# EAGLE design am (EAGLE 9.5.2)
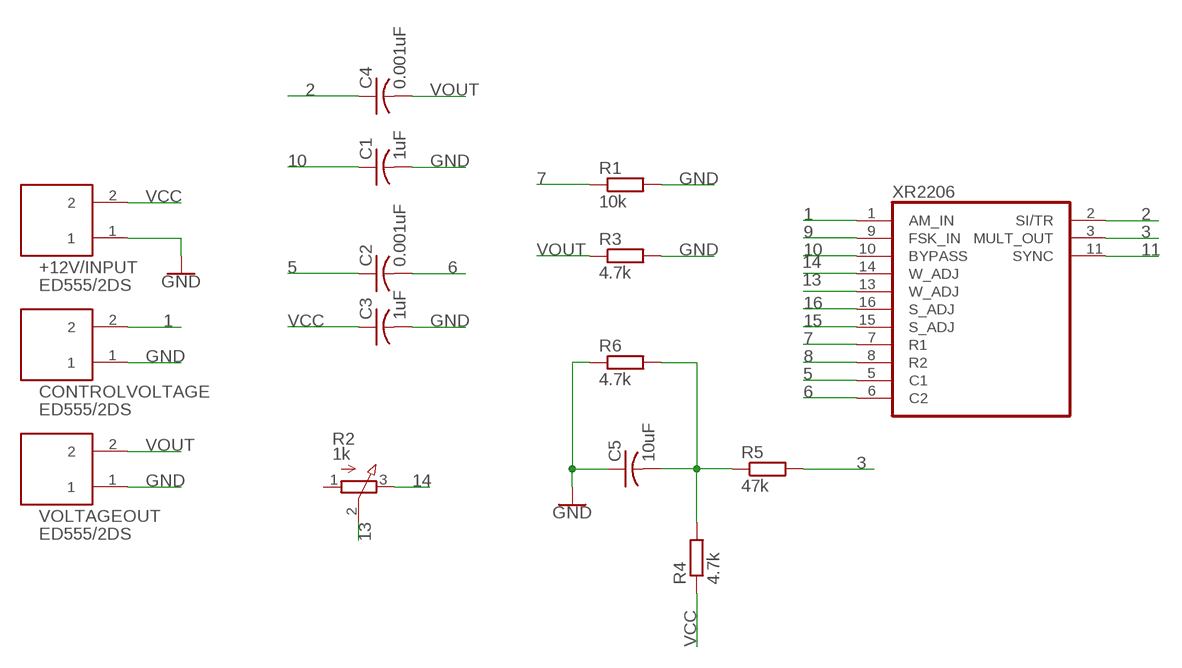
[diagram p0: schematic, sheet 1]

## Parts
+12V/INPUT  ED555/2DS  [ED555/2DS]
C1  1uF  C-US050-030X075  [C050-030X075]
C2  0.001uF  C-US050-030X075  [C050-030X075]
C3  1uF  C-US050-030X075  [C050-030X075]
C4  0.001uF  C-US050-030X075  [C050-030X075]
C5  10uF  C-US050-030X075  [C050-030X075]
CONTROLVOLTAGE  ED555/2DS  [ED555/2DS]
R1  10k  R-EU_0207/10  [0207/10]
R2  1k  3RP/1610N  [3RP/1610N]
R3  4.7k  R-EU_0207/10  [0207/10]
R4  4.7k  R-EU_0207/10  [0207/10]
R5  47k  R-EU_0207/10  [0207/10]
R6  4.7k  R-EU_0207/10  [0207/10]
VOLTAGEOUT  ED555/2DS  [ED555/2DS]
XR2206  XR-2206  [DIL16]

## Nets
1: CONTROLVOLTAGE.2 XR2206.1(AM_IN)
2: C4.1 XR2206.2(SI/TR)
3: R5.2 XR2206.3(MULT_OUT)
5: C2.1 XR2206.5(C1)
6: C2.2 XR2206.6(C2)
7: R1.1 XR2206.7(R1)
8: XR2206.8(R2)
9: XR2206.9(FSK_IN)
10: C1.1 XR2206.10(BYPASS)
11: XR2206.11(SYNC)
13: R2.2(S) XR2206.13(W_ADJ)
14: R2.3(E) XR2206.14(W_ADJ)
15: XR2206.15(S_ADJ)
16: XR2206.16(S_ADJ)
GND: +12V/INPUT.1 C1.2 C3.2 C5.1 CONTROLVOLTAGE.1 R1.2 R3.2 R6.1 VOLTAGEOUT.1
N$2: C5.2 R4.2 R5.1 R6.2
VCC: +12V/INPUT.2 C3.1 R4.1
VOUT: C4.2 R3.1 VOLTAGEOUT.2
Unconnected: R2.1(A)

## Power pins joined to a net without a drawn wire
GND: XR2206.12(GND)
VCC: XR2206.4(VCC)

## Library data of the parts
+12V/INPUT CONTROLVOLTAGE VOLTAGEOUT = DC_LOAD_AU:ED555/2DS: 2-Pin Terminal Block 3.5mm pitch 6A
C1-C5 = adafruit:C-US: CAPACITOR, American symbol
R1 R3-R6 = rcl:R-EU_: RESISTOR, European symbol; SPICEPREFIX: R
R2 = pot:3RP/1610N: 16mm Potentiometer one level Source: http://www.alphapotentiometers.net/html/16mm_pot_2.html
XR2206 = exar:XR-2206: Monolithic FUNCTION GENERATOR; OC_FARNELL: unknown; OC_NEWARK: unknown

## Net classes
0 default: width 0.305 mm, drill 0.508 mm, clearance 0.508 mm

## Board
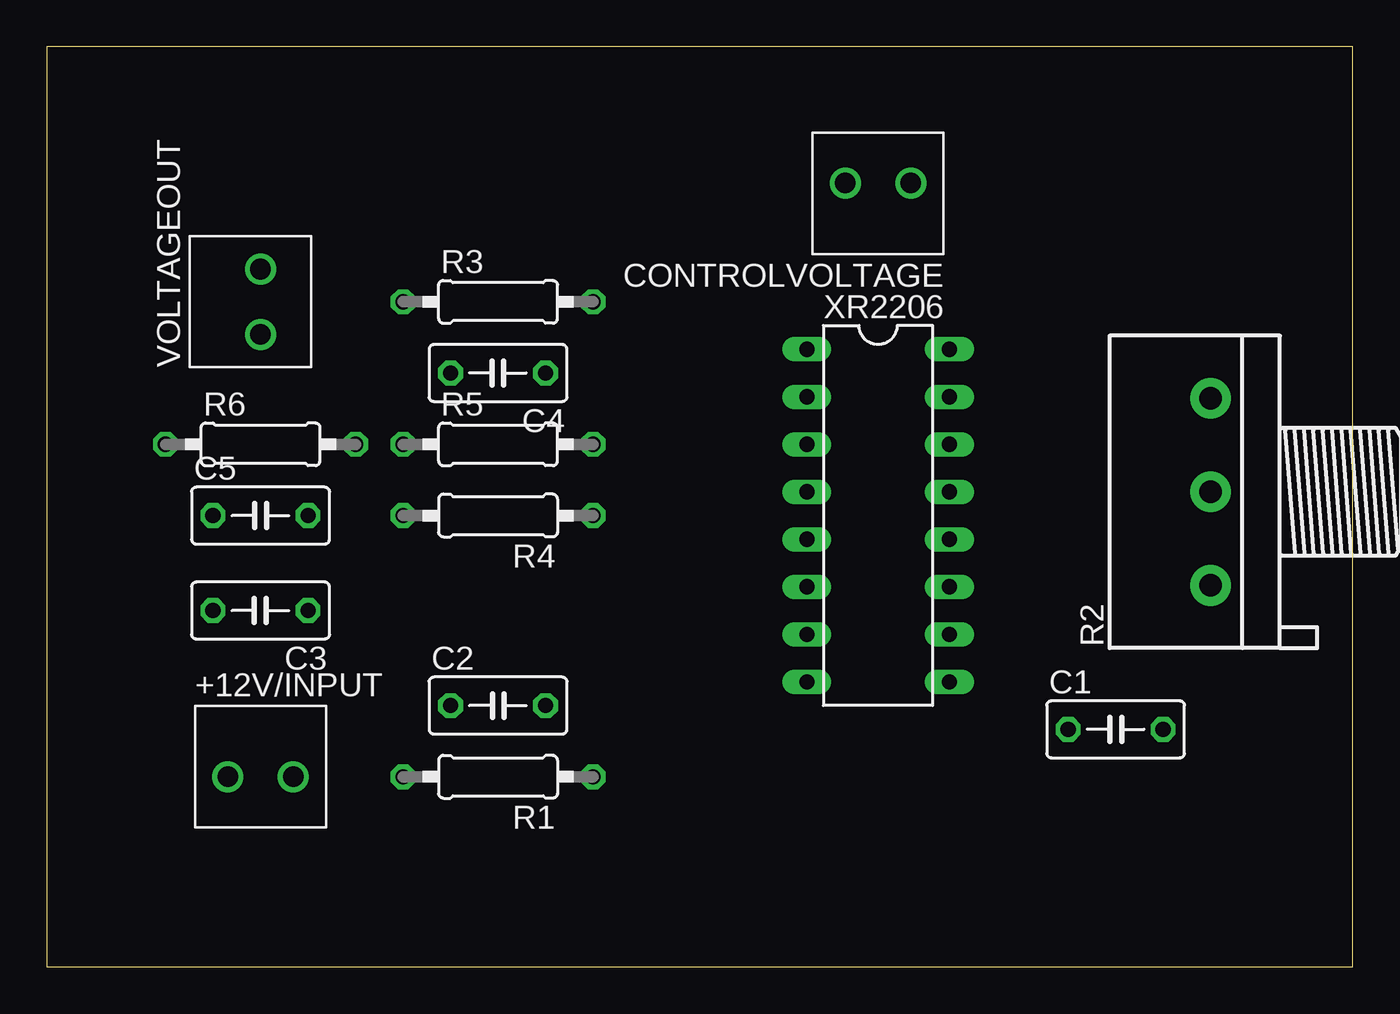
[diagram p1: board, top side]
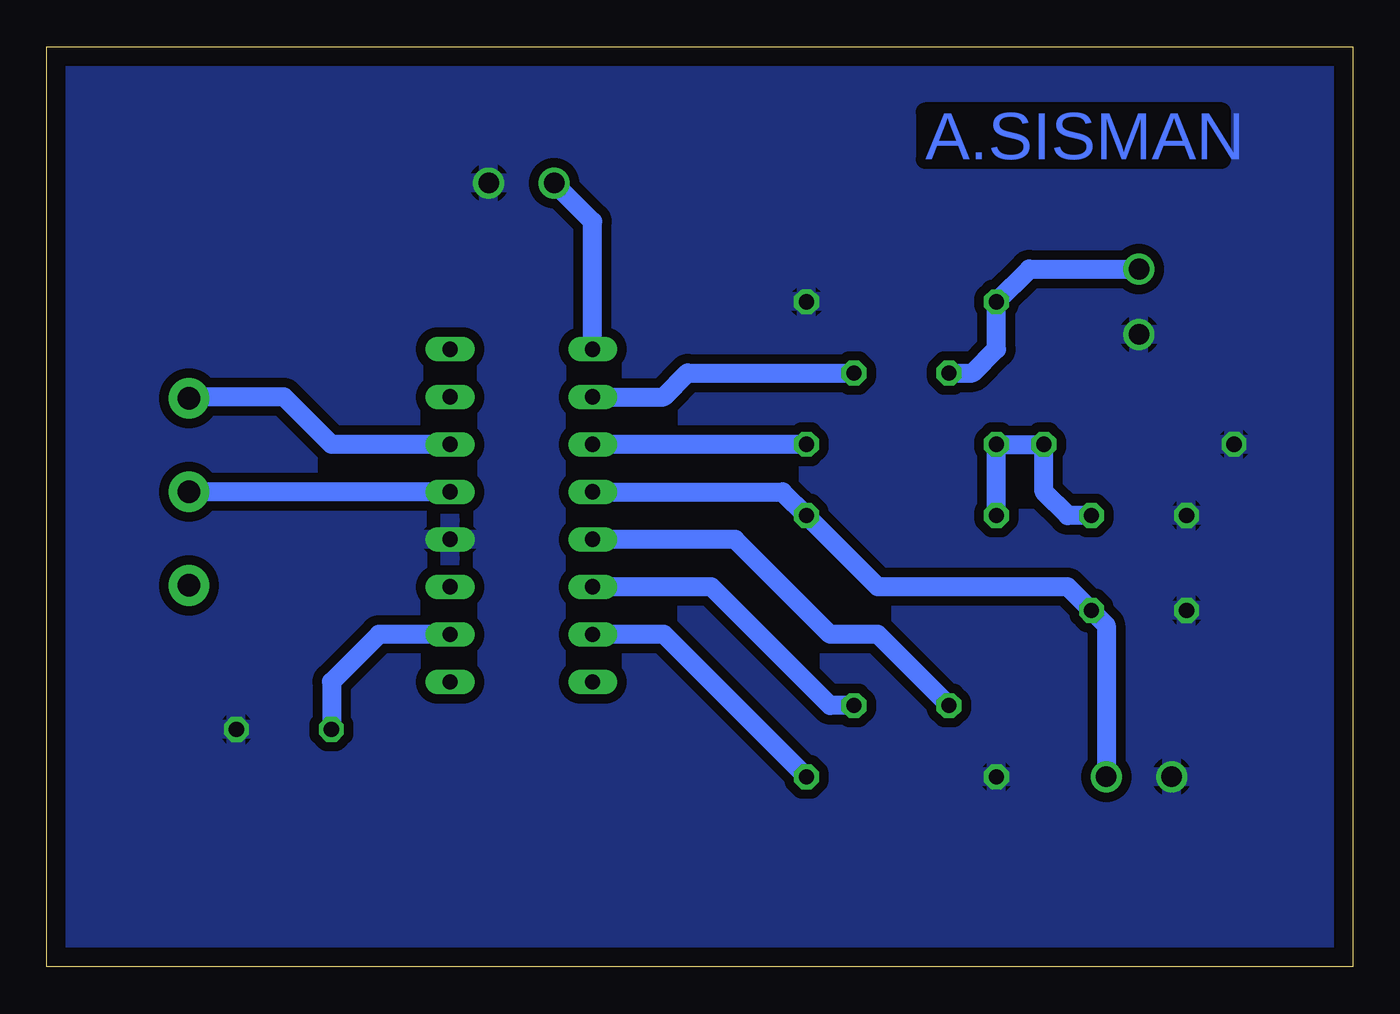
[diagram p2: board, bottom side, seen from below]

Size 69.83 x 49.2 mm. Coordinates in mm from the lower left corner, seen from the top.
Outline: 0,0 69.83,0 69.83,49.2 0,49.2 0,0
Copper layers (1*16): Top 0.035mm / dielectric 1.5mm / Bottom 0.035mm
Design rules "default": minimum track width 6mil, minimum drill 0.35mm, track to track 6mil, track to pad 6mil, pad to pad 6mil, via to via 6mil, smd to smd 6mil, copper to edge 40mil, drill to drill 6mil, minimum pad ring 10mil, minimum via ring 8mil, stop-mask expansion 4mil, vias tented up to drill 0mil, thermal gap 10mil

### Footprints (pad centres in the part's own frame; a part is rotated, then mirrored left to right if it is on the bottom)
ED555/2DS = drill 1.1: 1 -1.75,0; 2 1.75,0
C050-030X075 = drill 0.813 octagon: 1 -2.54,0; 2 2.54,0
0207/10 = drill 0.813 octagon: 1 -5.08,0; 2 5.08,0
3RP/1610N = drill 1.2 pad 2.184: 1 -5,0; 2 0,0; 3 5,0
DIL16 = drill 0.813 long: 1 -8.89,-3.81; 2 -6.35,-3.81; 3 -3.81,-3.81; 4 -1.27,-3.81; 5 1.27,-3.81; 6 3.81,-3.81; 7 6.35,-3.81; 8 8.89,-3.81; 9 8.89,3.81; 10 6.35,3.81; 11 3.81,3.81; 12 1.27,3.81; 13 -1.27,3.81; 14 -3.81,3.81; 15 -6.35,3.81; 16 -8.89,3.81

### Placement (x,y rotation side)
+12V/INPUT  11.43,10.16 0 top
C1  57.15,12.7 0 top
C2  24.13,13.97 0 top
C3  11.43,19.05 180 top
C4  24.13,31.75 180 top
C5  11.43,24.13 0 top
CONTROLVOLTAGE  44.45,41.91 180 top
R1  24.13,10.16 180 top
R2  62.23,25.4 90 top
R3  24.13,35.56 0 top
R4  24.13,24.13 180 top
R5  24.13,27.94 0 top
R6  11.43,27.94 0 top
VOLTAGEOUT  11.43,35.56 90 top
XR2206  44.45,24.13 270 top

### Tracks (layer width: path | path; a pad name or v marks a point on that pad's centre or on a via)
1
  Bottom 1.016: CONTROLVOLTAGE.2 40.64,39.85 XR2206.1
2
  Bottom 1.016: XR2206.2 36.83,30.48 35.56,31.75 C4.1
3
  Bottom 1.016: R5.2 XR2206.3
5
  Bottom 1.016: C2.1 25.4,17.78 27.94,17.78 33.02,22.86 XR2206.5
6
  Bottom 1.016: XR2206.6 34.29,20.32 27.94,13.97 C2.2
7
  Bottom 1.016: R1.1 36.83,17.78 XR2206.7
10
  Bottom 1.016: XR2206.10 52.07,17.78 54.61,15.24 C1.1
13
  Bottom 1.016: XR2206.13 R2.2
14
  Bottom 1.016: XR2206.14 54.61,27.94 57.15,30.48 62.15,30.48 R2.3
GND
  pour Bottom: -1.27,49.53 -1.27,-1.27 71.12,-1.27 71.12,50.8 -1.27,50.8
N$2
  Bottom 1.016: C5.2 15.24,24.13 16.51,25.4 R6.2 R5.1 R4.2
VCC
  Bottom 1.016: XR2206.4 30.48,25.4 R4.1 25.4,20.32 15.24,20.32 C3.1 13.18,18.26 +12V/INPUT.2
VOUT
  Bottom 1.016: C4.2 20.32,31.75 19.05,33.02 R3.1 17.3,37.31 VOLTAGEOUT.2

### Text on the board
Bottom: A.SISMAN